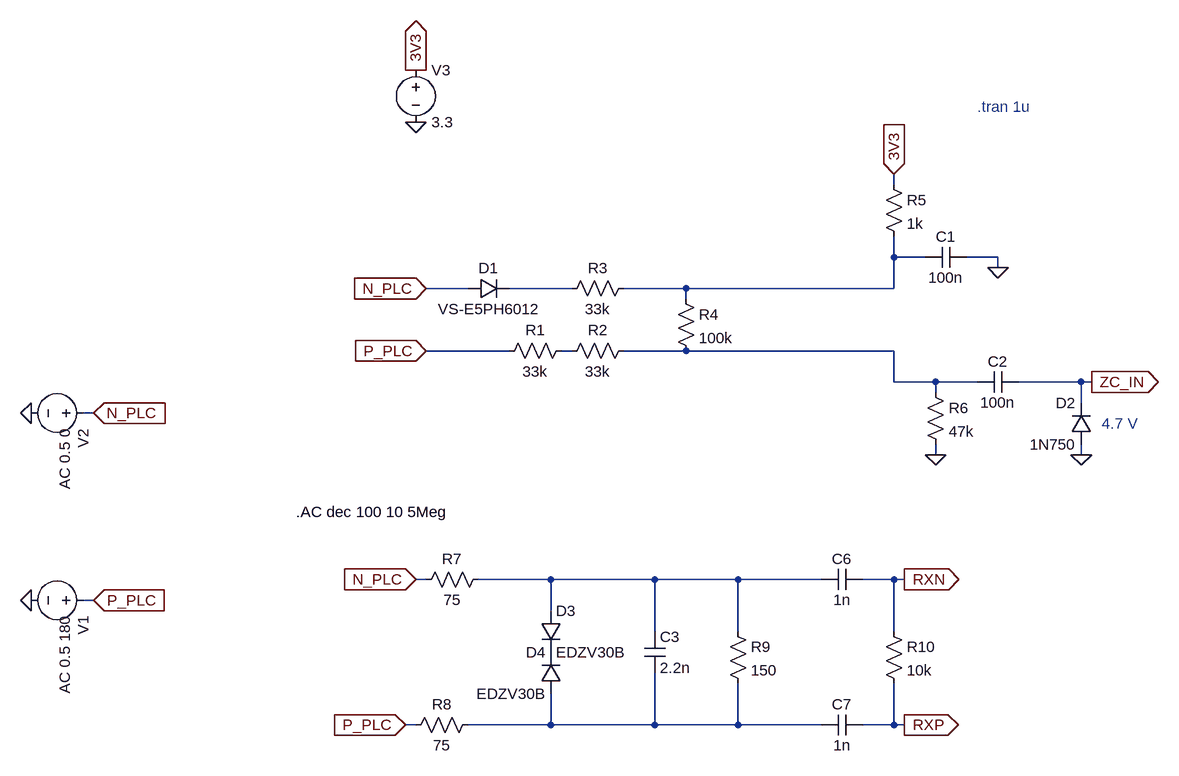
[diagram p0: schematic plc.asc]
plc.asc, the LTspice schematic file:
Version 4.1
SHEET 1 1492 900
WIRE 848 -144 848 -160
WIRE 848 -32 848 -64
WIRE 896 -32 848 -32
WIRE 1008 -32 960 -32
WIRE 1008 -16 1008 -32
WIRE 192 16 128 16
WIRE 352 16 256 16
WIRE 528 16 432 16
WIRE 848 16 848 -32
WIRE 848 16 528 16
WIRE 528 32 528 16
WIRE 256 112 128 112
WIRE 352 112 336 112
WIRE 528 112 432 112
WIRE 848 112 528 112
WIRE 848 160 848 112
WIRE 912 160 848 160
WIRE 976 160 912 160
WIRE 1136 160 1040 160
WIRE 1152 160 1136 160
WIRE 912 176 912 160
WIRE 1136 192 1136 160
WIRE -384 208 -400 208
WIRE 912 272 912 256
WIRE 1136 272 1136 256
WIRE 128 464 112 464
WIRE 320 464 208 464
WIRE 480 464 320 464
WIRE 608 464 480 464
WIRE 736 464 608 464
WIRE 848 464 800 464
WIRE 864 464 848 464
WIRE -384 496 -400 496
WIRE 320 512 320 464
WIRE 480 544 480 464
WIRE 608 544 608 464
WIRE 848 544 848 464
WIRE 112 688 96 688
WIRE 320 688 320 640
WIRE 320 688 192 688
WIRE 480 688 480 608
WIRE 480 688 320 688
WIRE 608 688 608 624
WIRE 608 688 480 688
WIRE 736 688 608 688
WIRE 848 688 848 624
WIRE 848 688 800 688
WIRE 864 688 848 688
FLAG 112 -320 3V3
IOPIN 112 -320 Out
FLAG 112 -240 0
FLAG 848 -160 3V3
IOPIN 848 -160 In
FLAG 1152 160 ZC_IN
IOPIN 1152 160 Out
FLAG 912 272 0
FLAG 1136 272 0
FLAG 1008 -16 0
FLAG 112 464 N_PLC
IOPIN 112 464 In
FLAG 96 688 P_PLC
IOPIN 96 688 In
FLAG 864 464 RXN
IOPIN 864 464 Out
FLAG 864 688 RXP
IOPIN 864 688 Out
FLAG -384 496 P_PLC
IOPIN -384 496 In
FLAG -480 496 0
FLAG -384 208 N_PLC
IOPIN -384 208 In
FLAG -480 208 0
FLAG 128 16 N_PLC
IOPIN 128 16 In
FLAG 128 112 P_PLC
IOPIN 128 112 In
SYMBOL voltage -384 496 R90
WINDOW 3 39 56 Left 2
WINDOW 123 24 44 Left 2
WINDOW 39 0 0 Left 0
SYMATTR Value ""
SYMATTR Value2 AC 0.5 180
SYMATTR InstName V1
SYMBOL diode 192 32 R270
WINDOW 0 32 32 VTop 2
WINDOW 3 0 32 VBottom 2
SYMATTR InstName D1
SYMATTR Value VS-E5PH6012
SYMBOL res 352 96 R90
WINDOW 0 0 56 VBottom 2
WINDOW 3 32 56 VTop 2
SYMATTR InstName R1
SYMATTR Value 33k
SYMBOL res 448 96 R90
WINDOW 0 0 56 VBottom 2
WINDOW 3 32 56 VTop 2
SYMATTR InstName R2
SYMATTR Value 33k
SYMBOL res 448 0 R90
WINDOW 0 0 56 VBottom 2
WINDOW 3 32 56 VTop 2
SYMATTR InstName R3
SYMATTR Value 33k
SYMBOL res 512 16 R0
SYMATTR InstName R4
SYMATTR Value 100k
SYMBOL voltage 112 -336 R0
WINDOW 123 0 0 Left 0
WINDOW 39 0 0 Left 0
SYMATTR InstName V3
SYMATTR Value 3.3
SYMBOL cap 960 -48 R90
WINDOW 0 0 32 VBottom 2
WINDOW 3 32 32 VTop 2
SYMATTR InstName C1
SYMATTR Value 100n
SYMBOL res 832 -160 R0
SYMATTR InstName R5
SYMATTR Value 1k
SYMBOL cap 1040 144 R90
WINDOW 0 0 32 VBottom 2
WINDOW 3 32 32 VTop 2
SYMATTR InstName C2
SYMATTR Value 100n
SYMBOL res 896 160 R0
SYMATTR InstName R6
SYMATTR Value 47k
SYMBOL diode 1152 256 R180
WINDOW 0 24 64 Left 2
WINDOW 3 24 0 Left 2
SYMATTR InstName D2
SYMATTR Value 1N750
SYMBOL res 224 448 R90
WINDOW 0 0 56 VBottom 2
WINDOW 3 32 56 VTop 2
SYMATTR InstName R7
SYMATTR Value 75
SYMBOL res 208 672 R90
WINDOW 0 0 56 VBottom 2
WINDOW 3 32 56 VTop 2
SYMATTR InstName R8
SYMATTR Value 75
SYMBOL diode 304 512 R0
SYMATTR InstName D3
SYMATTR Value EDZV30B
SYMBOL diode 336 640 R180
WINDOW 0 24 64 Left 2
WINDOW 3 24 0 Left 2
SYMATTR InstName D4
SYMATTR Value EDZV30B
SYMBOL cap 464 544 R0
SYMATTR InstName C3
SYMATTR Value 2.2n
SYMBOL res 592 528 R0
SYMATTR InstName R9
SYMATTR Value 150
SYMBOL cap 800 448 R90
WINDOW 0 0 32 VBottom 2
WINDOW 3 32 32 VTop 2
SYMATTR InstName C6
SYMATTR Value 1n
SYMBOL cap 800 672 R90
WINDOW 0 0 32 VBottom 2
WINDOW 3 32 32 VTop 2
SYMATTR InstName C7
SYMATTR Value 1n
SYMBOL voltage -384 208 R90
WINDOW 3 39 56 Left 2
WINDOW 123 24 44 Left 2
WINDOW 39 0 0 Left 0
SYMATTR Value ""
SYMATTR Value2 AC 0.5 0
SYMATTR InstName V2
SYMBOL res 832 528 R0
SYMATTR InstName R10
SYMATTR Value 10k
TEXT 976 -264 Left 2 ;.tran 1u
TEXT 1168 224 Left 2 ;4.7 V
TEXT -72 360 Left 2 !.AC dec 100 10 5Meg

The netlist it stands for:
* plc.asc
V1 P_PLC 0 AC 0.5 180
D1 N_PLC N002 VS-E5PH6012
R1 N003 P_PLC 33k
R2 N004 N003 33k
R3 N001 N002 33k
R4 N001 N004 100k
V3 3V3 0 3.3
C1 0 N001 100n
R5 3V3 N001 1k
C2 ZC_IN N004 100n
R6 N004 0 47k
D2 0 ZC_IN 1N750
R7 N005 N_PLC 75
R8 N006 P_PLC 75
D3 N005 P001 EDZV30B
D4 N006 P001 EDZV30B
C3 N005 N006 2.2n
R9 N005 N006 150
C6 RXN N005 1n
C7 RXP N006 1n
V2 N_PLC 0 AC 0.5 0
R10 RXN RXP 10k
.model D D
.lib standard.dio
* .tran 1u
* 4.7 V
.AC dec 100 10 5Meg
.backanno
.end